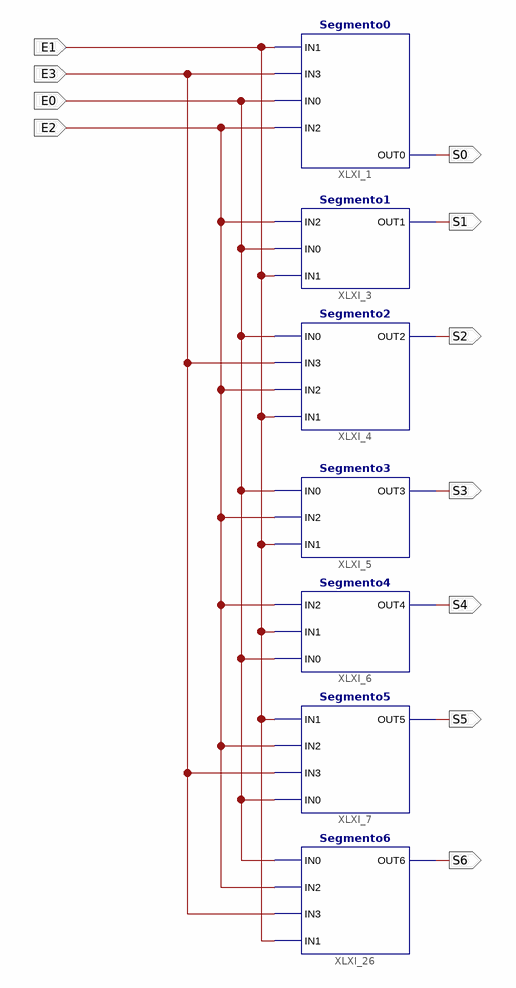
[diagram p0: schematic sheet 1]
// Xilinx ISE schematic SieteSegmentos.sch (spartan3e) as structural Verilog: 7 symbols, 11 ports
module SieteSegmentos (
  input  E1,
  input  E3,
  input  E2,
  input  E0,
  output S0,
  output S1,
  output S2,
  output S3,
  output S4,
  output S5,
  output S6
);

  Segmento0 XLXI_1 (.IN2(E2), .IN0(E0), .IN3(E3), .IN1(E1), .OUT0(S0));
  Segmento1 XLXI_3 (.IN2(E2), .IN0(E0), .IN1(E1), .OUT1(S1));
  Segmento2 XLXI_4 (.IN0(E0), .IN3(E3), .IN2(E2), .IN1(E1), .OUT2(S2));
  Segmento3 XLXI_5 (.IN0(E0), .IN2(E2), .IN1(E1), .OUT3(S3));
  Segmento4 XLXI_6 (.IN2(E2), .IN1(E1), .IN0(E0), .OUT4(S4));
  Segmento5 XLXI_7 (.IN1(E1), .IN2(E2), .IN0(E0), .IN3(E3), .OUT5(S5));
  Segmento6 XLXI_26 (.IN0(E0), .IN2(E2), .IN3(E3), .IN1(E1), .OUT6(S6));
endmodule
